# Altium schematic sheet LED_board_schematic_pg_1.SchDoc
size A4; SheetNumber: 1; SheetTotal: 2
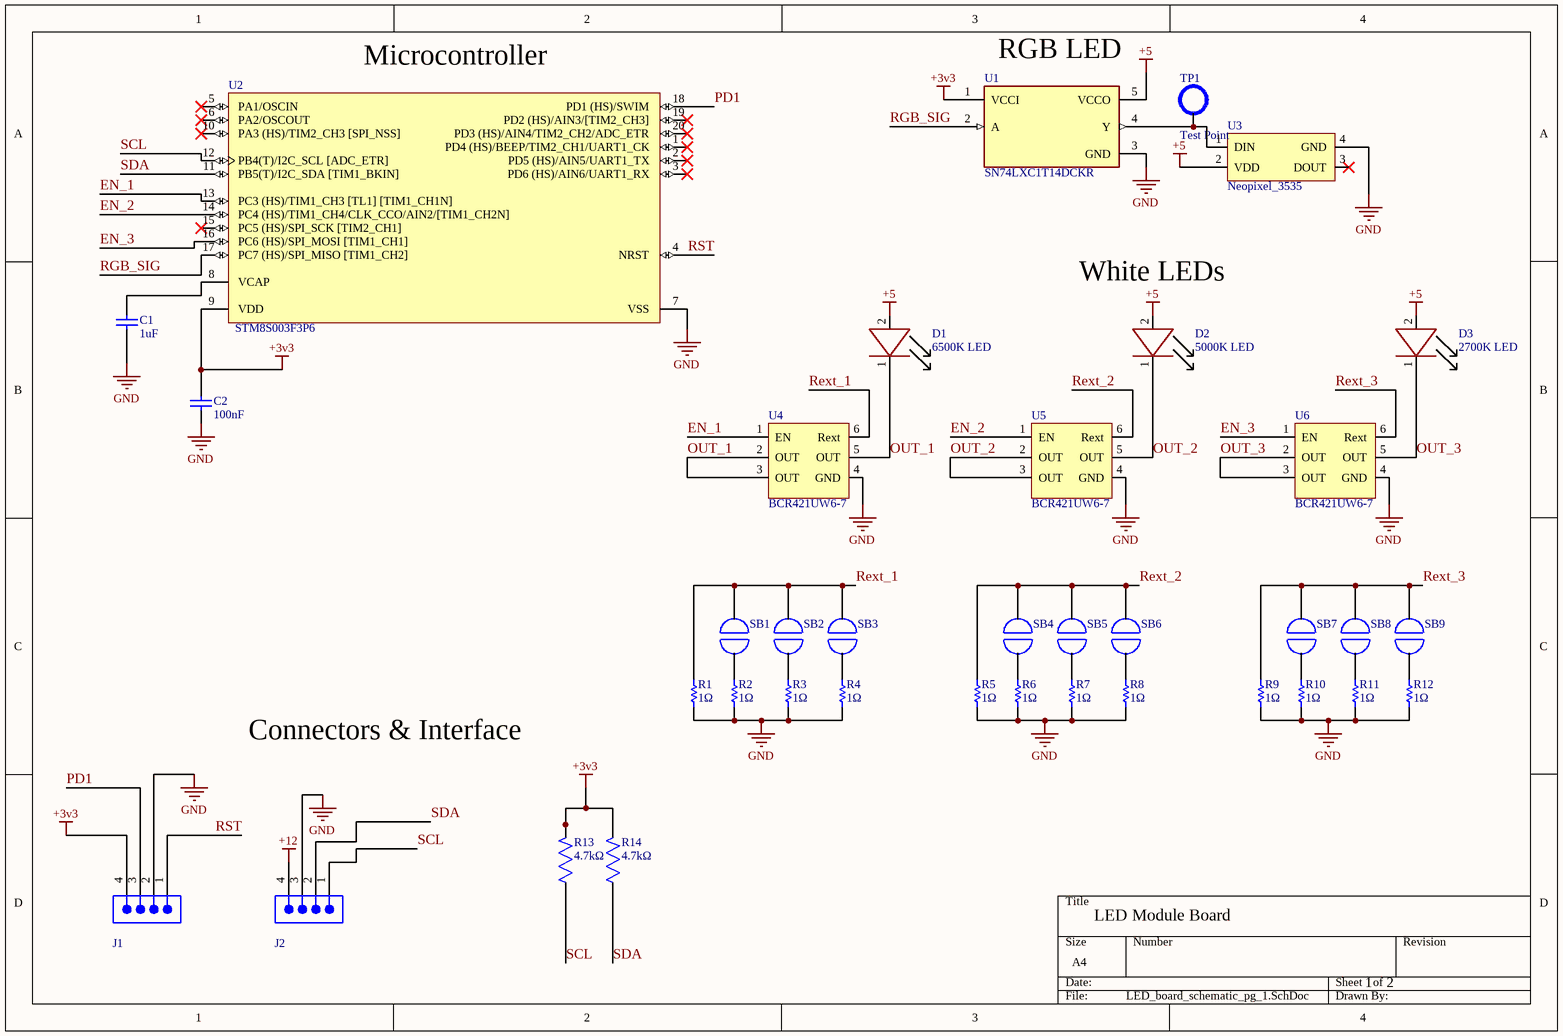
[diagram p0: LED_board_schematic_pg_1.SchDoc]

## Parts
C1  1uF  [0402 PACKAGE]
C2  100nF  [0402 PACKAGE]
D1  6500K LED  [LED Package Top]
D2  5000K LED  [LED Package Top]
D3  2700K LED  [LED Package Top]
J1  61300411121  [61300411121]  (value not drawn)
J2  61300411121  [61300411121]  (value not drawn)
R1  1Ω  [RESC1609X50X30NL10T20]
R2  1Ω  [RESC1609X50X30NL10T20]
R3  1Ω  [RESC1609X50X30NL10T20]
R4  1Ω  [RESC1609X50X30NL10T20]
R5  1Ω  [RESC1609X50X30NL10T20]
R6  1Ω  [RESC1609X50X30NL10T20]
R7  1Ω  [RESC1609X50X30NL10T20]
R8  1Ω  [RESC1609X50X30NL10T20]
R9  1Ω  [RESC1609X50X30NL10T20]
R10  1Ω  [RESC1609X50X30NL10T20]
R11  1Ω  [RESC1609X50X30NL10T20]
R12  1Ω  [RESC1609X50X30NL10T20]
R13  4.7kΩ  [0402 PACKAGE]
R14  4.7kΩ  [0402 PACKAGE]
SB1  Solder Bridge  [Solder Bridge]  (value not drawn)
SB2  Solder Bridge  [Solder Bridge]  (value not drawn)
SB3  Solder Bridge  [Solder Bridge]  (value not drawn)
SB4  Solder Bridge  [Solder Bridge]  (value not drawn)
SB5  Solder Bridge  [Solder Bridge]  (value not drawn)
SB6  Solder Bridge  [Solder Bridge]  (value not drawn)
SB7  Solder Bridge  [Solder Bridge]  (value not drawn)
SB8  Solder Bridge  [Solder Bridge]  (value not drawn)
SB9  Solder Bridge  [Solder Bridge]  (value not drawn)
TP1  Test Point  [Test Point]
U1  SN74LXC1T14DCKR  [FP-DCK0005A-MFG]
U2  STM8S003F3P6  [STM-TSSOP20_V]
U3  Neopixel_3535  [Neopixel]
U4  BCR421UW6-7  [SOT95P280X140-6N]
U5  BCR421UW6-7  [SOT95P280X140-6N]
U6  BCR421UW6-7  [SOT95P280X140-6N]

## Nets
+3v3: C2.2 J1.4 R13.2 R14.2 U1.1(VCCI) U2.9(VDD)
+5: D1.2 D2.2 D3.2 U1.5(VCCO) U3.2(VDD)
+12: J2.4
GND: C1.1 C2.1 J1.2 J2.3 R1.1 R2.1 R3.1 R4.1 R5.1 R6.1 R7.1 R8.1 R9.1 R10.1 R11.1 R12.1 U1.3(GND) U2.7(VSS) U3.4(GND) U4.4(GND) U5.4(GND) U6.4(GND)
EN_1: U2.13(PC3_(HS)/TIM1_CH3_[TL1]_[TIM1_CH1N]) U4.1(EN)
EN_2: U2.14(PC4_(HS)/TIM1_CH4/CLK_CCO/AIN2/[TIM1_CH2N]) U5.1(EN)
EN_3: U2.16(PC6_(HS)/SPI_MOSI_[TIM1_CH1]) U6.1(EN)
OUT_1: D1.1 U4.2(OUT) U4.3(OUT) U4.5(OUT)
OUT_2: D2.1 U5.2(OUT) U5.3(OUT) U5.5(OUT)
OUT_3: D3.1 U6.2(OUT) U6.3(OUT) U6.5(OUT)
PD1: J1.3 U2.18(PD1_(HS)/SWIM)
Rext_1: R1.2 SB1.1 SB2.1 SB3.1 U4.6(Rext)
Rext_2: R5.2 SB4.1 SB5.1 SB6.1 U5.6(Rext)
Rext_3: R9.2 SB7.1 SB8.1 SB9.1 U6.6(Rext)
RGB_SIG: U1.2(A) U2.17(PC7_(HS)/SPI_MISO_[TIM1_CH2])
RST: J1.1 U2.4(NRST)
SCL: J2.1 R13.1 U2.12(PB4(T)/I2C_SCL_[ADC_ETR])
SDA: J2.2 R14.1 U2.11(PB5(T)/I2C_SDA_[TIM1_BKIN])
NetC1_2: C1.2 U2.8(VCAP)
NetR2_2: R2.2 SB1.2
NetR3_2: R3.2 SB2.2
NetR4_2: R4.2 SB3.2
NetR6_2: R6.2 SB4.2
NetR7_2: R7.2 SB5.2
NetR8_2: R8.2 SB6.2
NetR10_2: R10.2 SB7.2
NetR11_2: R11.2 SB8.2
NetR12_2: R12.2 SB9.2
NetTP1_1: TP1.1 U1.4(Y) U3.1(DIN)

Not connected (* = marked no-connect by the designer): U2 1(PD4_(HS)/BEEP/TIM2_CH1/UART1_CK)* 2(PD5_(HS)/AIN5/UART1_TX)* 3(PD6_(HS)/AIN6/UART1_RX)* 5(PA1/OSCIN)* 6(PA2/OSCOUT)* 10(PA3_(HS)/TIM2_CH3_[SPI_NSS])* 15(PC5_(HS)/SPI_SCK_[TIM2_CH1])* 19(PD2_(HS)/AIN3/[TIM2_CH3])* 20(PD3_(HS)/AIN4/TIM2_CH2/ADC_ETR)*; U3 3(DOUT)*

## Notes on the sheet
- (near U2) Microcontroller
- (near U1) RGB LED
- (near D2) White LEDs
- Connectors & Interface
- LED Module Board
- 1    2

## Library data of the parts
C1 = Capacitor: CAP CER 1UF 10V X5R 0402
C2 = Capacitor: CAP CER 0.1UF 10V X5R 0402
J1 J2 = CMP-1502-01064-3: NexarPartId: 32855522; Operating Supply Voltage: 250V; Pitch: 2.54mm; Contact Resistance: 20mΩ; Number of Positions: 4; Current Rating: 3A; Connector Type: Male Pin; Gender: Male; Contact Plating: Gold; Height: 8.89mm; Lead Pitch: 2.54mm; Lead Free: Lead Free; Contact Mating Length: 5.9944mm; Number of Rows: 1; Termination: Solder; Packaging: Bulk; REACH SVHC: Unknown; Min Operating Temperature: -40°C; RoHS: Compliant; Number of Contacts: 4; Voltage Rating: 250V; Color: Black; Max Operating Temperature: 105°C; Contact Material: Copper; Mount: Through Hole; Orientation: Vertical; Number of Pins: 4
R1-R12 = CMP-1012-00171-2: Manufacturer: Vishay Dale; Part Number: CRCW06031R00FKEA
R13 R14 = Resistor
U1 = CMP-04899-000130-1: IC TRANSLATOR UNIDIR SC70-5
U2 = CMP-2000-07166-1: Value Line, 16 MHz STM8S 8-Bit MCU, 8 Kbyte Flash, 128 Byte Data EEPROM, 10-Bit ADC, 3 Timers, 2.95 to 5.5 V, -40 to 85 degC, 20-Pin TSSOP, RoHS, Tube; Manufacturer: STMicroelectronics; Connectivity: I²C,IrDA,LIN,SPI,UART/USART; Featured Product: FlasherSeriesofProductionTools; Program Memory Size: 8KB(8Kx8); Oscillator Type: Internal; Other Names: 497-11946-5; Core Processor: STM8; Package Version: Rev. 2, 01/2015; Peripherals: Brown-outDetect/Reset,POR,PWM,WDT; Data Converters: A/D5x10b; Other Related Documents: STM8S003F3ViewAllSpecifications; Number of I/Os: 16; EEPROM Size: 128x8; Speed: 16MHz; RAM Size: 1Kx8; Voltage - Supply (Vcc/Vdd): 2.95V~5.5V; Series: STM8S; Category: IntegratedCircuits(ICs); Program Memory Type: FLASH; Packaging: Tube; Datasheet Version: Rev. 8, 04/2016; Manufacturer URL: http://www.st.com/; Package URL: http://www.st.com/st-web-ui/static/active/en/resource/technical/document/datasheet/DM00141386.pdf; Operating Temperature: -40°C~85°C; Package / Case: 20-TSSOP(0.173",4.40mmWidth); Standard Package: 74; Family: Embedded-Microcontrollers; Datasheet URL: http://www2.st.com/content/ccc/resource/technical/document/datasheet/42/5a/27/87/ac/5a/44/88/DM00024550.pdf/files/DM00024550.pdf/jcr:content/translations/en.DM00024550.pdf; Package Description: 20-Pin Thin Shrink Small Outline Package, Body 6.5 x 4.4 mm, Pitch 0.65 mm; Core Size: 8-Bit; Package Reference: TSSOP20; Mounting Technology: SurfaceMount; Dynamic Catalog: STM8S; Number of I /O: 16
U4-U6 = BCR421UW6-7: LED Driver
D1 = 6500K LED: Supplier 1: Digikey; Supplier Part Number 1: 475-GWPLLRA1.CM-M7N2-XX53-1-700-R18CT-ND
D2 = 5000K LED: Supplier 1: Digikey; Supplier Part Number 1: 475-GWPLLRA1.CM-M7N2-XX51-1-700-R18CT-ND
D3 = 2700K LED: Supplier 1: Digikey; Supplier Part Number 1: 475-GWPLLRA1.CM-M3M8-XX58-1-700-R18CT-ND